# Altium project NguonLM2596ADJ.PrjPcb
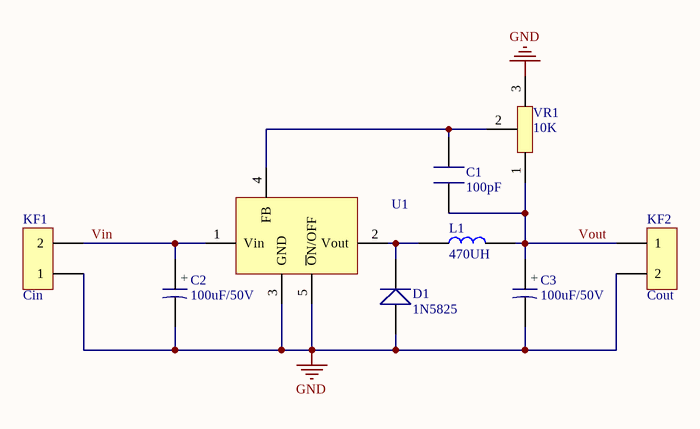
[diagram p0: LM2596.SchDoc]
1 sheet, 9 parts. Net scope: global (net labels, ports and power ports of the same name join across sheets).
Board file: lm2596PCB.PcbDoc

## Sheet LM2596.SchDoc
size A

### Parts
C1  100pF  [C104 0603 SMD]
C2  100uF/50V  [UUD1H101MNL1GS]
C3  100uF/50V  [UUD1H101MNL1GS]
D1  1N5825  [SS34-SMA]
KF1  Cin  [KF126]
KF2  Cout  [KF126]
L1  470UH  [RH127-471]
U1  LM2596-ADJ  [TO263-5]  (value not drawn)
VR1  10K  [RM065-203]

### Nets
GND: C2.2 C3.2 D1.1 KF1.1 KF2.2 U1.3(GND) U1.5(~{O}N/OFF) VR1.3
Vin: C2.1(+) KF1.2 U1.1(Vin)
Vout: C1.1 C3.1(+) KF2.1 L1.2 VR1.1
NetC1_2: C1.2 U1.4(FB) VR1.2
NetD1_2: D1.2 L1.1 U1.2(Vout)

### Library data of the parts
C1 = C104 SMD: 0603 SMD CAP; Supplier Part Number 2: 478-1175-1-ND
C2 C3 = 100uF/50V: CAP ALUM 100UF 50V SMD; Supplier 1: Digi-Key; Supplier Part Number 1: 493-2306-1-ND
D1 = Schottky 3A 40V SMA: DIODE SCHOTTKY 3A 40V SMA; Supplier 1: Digi-Key; Supplier Part Number 1: B340LA-FDICT-ND
KF1 KF2 = KF2: 2P-KF126 Domino
L1 = L SMD: 470UH 0.79A, Size 12 x 12 x 8, SMD Inductor; Supplier 1: Digi-Key; Supplier Part Number 1: 595-1460-1-ND
U1 = LM2596: IC BUCK ADJ 3A TO263-5; Supplier 1: Digi-Key; Supplier Part Number 1: LM2596S-ADJ/NOPB-ND
VR1 = VR Res